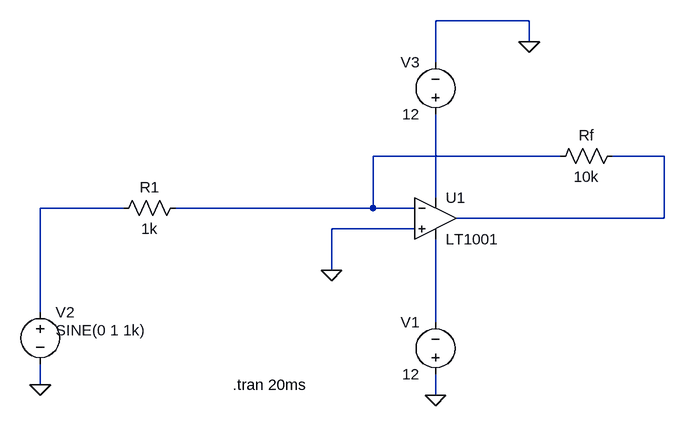
[diagram p0: schematic amplifier circuit.asc]
amplifier circuit.asc, the LTspice schematic file:
Version 4
SHEET 1 880 680
WIRE 400 -176 256 -176
WIRE 400 -144 400 -176
WIRE 256 -112 256 -176
WIRE 448 32 160 32
WIRE 608 32 528 32
WIRE 256 96 256 -32
WIRE -224 112 -352 112
WIRE 160 112 160 32
WIRE 160 112 -144 112
WIRE 224 112 160 112
WIRE 608 128 608 32
WIRE 608 128 288 128
WIRE 224 144 96 144
WIRE 96 208 96 144
WIRE -352 272 -352 112
WIRE 256 288 256 160
WIRE -352 384 -352 352
WIRE 256 400 256 368
FLAG 96 208 0
FLAG 256 400 0
FLAG 400 -144 0
FLAG -352 384 0
SYMBOL voltage 256 384 R180
WINDOW 0 24 96 Left 2
WINDOW 3 24 16 Left 2
WINDOW 123 0 0 Left 0
WINDOW 39 0 0 Left 0
SYMATTR InstName V1
SYMATTR Value 12
SYMBOL voltage -352 256 R0
WINDOW 3 24 44 Left 2
WINDOW 123 0 0 Left 0
WINDOW 39 0 0 Left 0
SYMATTR InstName V2
SYMATTR Value SINE(0 1 1k)
SYMBOL voltage 256 -16 R180
WINDOW 0 24 96 Left 2
WINDOW 3 24 16 Left 2
WINDOW 123 0 0 Left 0
WINDOW 39 0 0 Left 0
SYMATTR InstName V3
SYMATTR Value 12
SYMBOL Opamps\\LT1001 256 64 R0
SYMATTR InstName U1
SYMBOL res -128 96 R90
WINDOW 0 0 56 VBottom 2
WINDOW 3 32 56 VTop 2
SYMATTR InstName R1
SYMATTR Value 1k
SYMBOL res 544 16 R90
WINDOW 0 0 56 VBottom 2
WINDOW 3 32 56 VTop 2
SYMATTR InstName Rf
SYMATTR Value 10k
TEXT -56 384 Left 2 !.tran 20ms

The netlist it stands for:
* amplifier circuit.asc
V1 0 N005 12
V2 N004 0 SINE(0 1 1k)
V3 N003 0 12
XU1 0 N001 N003 N005 N002 LT1001  ; pins In+ In- V+ V- OUT
R1 N001 N004 1k
Rf N002 N001 10k
.tran 20ms
.lib LTC.lib
.backanno
.end